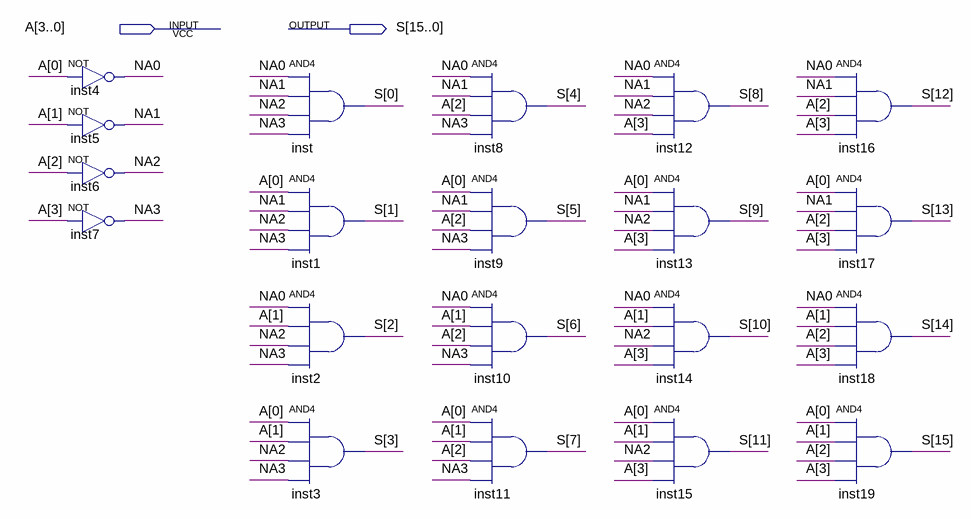
[diagram p0: schematic sheet]
// Quartus schematic DEC_16.bdf as structural Verilog: 20 symbols, 2 pins
module DEC_16 (
  input  [3:0] A,
  output [15:0] S
);

  wire NA0, NA1, NA2, NA3;

  not inst4 (NA0, A[0]);
  not inst5 (NA1, A[1]);
  not inst6 (NA2, A[2]);
  not inst7 (NA3, A[3]);
  and inst (S[0], NA0, NA1, NA2, NA3);
  and inst1 (S[1], A[0], NA1, NA2, NA3);
  and inst2 (S[2], NA0, A[1], NA2, NA3);
  and inst3 (S[3], A[0], A[1], NA2, NA3);
  and inst8 (S[4], NA0, NA1, A[2], NA3);
  and inst9 (S[5], A[0], NA1, A[2], NA3);
  and inst10 (S[6], NA0, A[1], A[2], NA3);
  and inst11 (S[7], A[0], A[1], A[2], NA3);
  and inst12 (S[8], NA0, NA1, NA2, A[3]);
  and inst13 (S[9], A[0], NA1, NA2, A[3]);
  and inst14 (S[10], NA0, A[1], NA2, A[3]);
  and inst15 (S[11], A[0], A[1], NA2, A[3]);
  and inst16 (S[12], NA0, NA1, A[2], A[3]);
  and inst17 (S[13], A[0], NA1, A[2], A[3]);
  and inst18 (S[14], NA0, A[1], A[2], A[3]);
  and inst19 (S[15], A[0], A[1], A[2], A[3]);
endmodule
